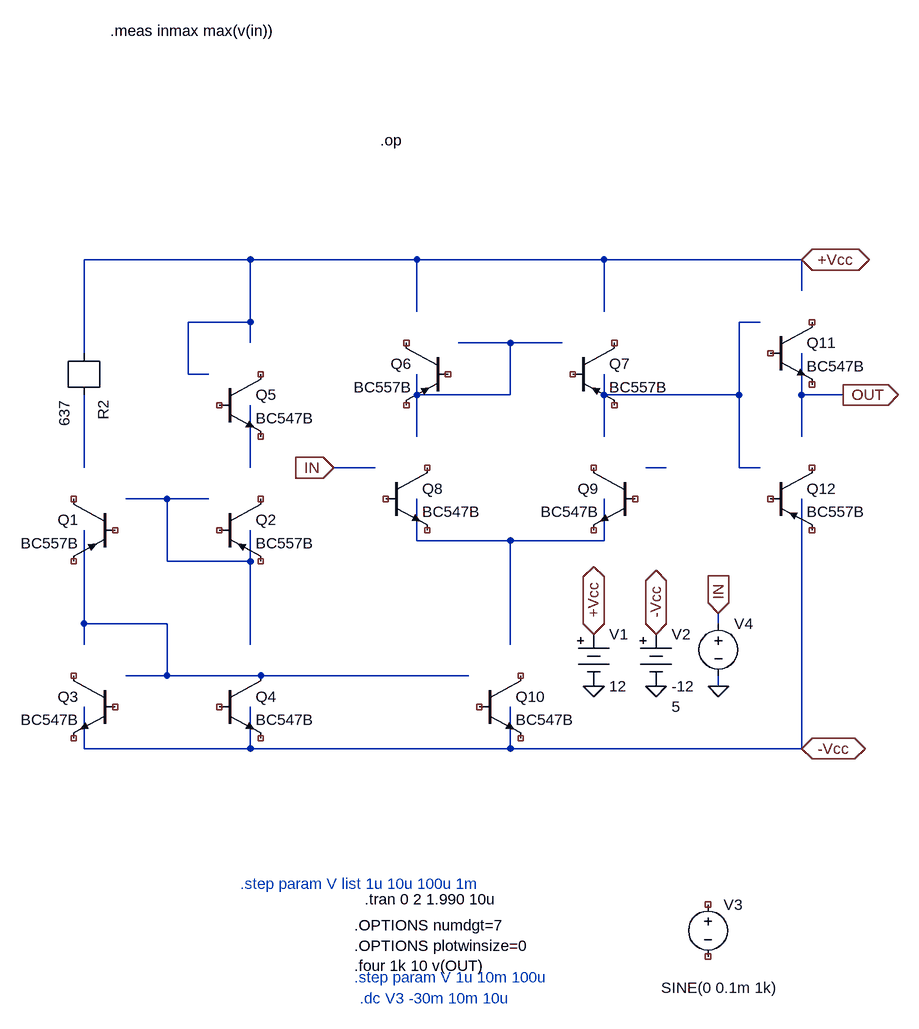
[diagram p0: schematic diff_amp_simple.asc]
diff_amp_simple.asc, the LTspice schematic file:
Version 4
SHEET 1 1452 1264
WIRE 448 112 192 112
WIRE 704 112 448 112
WIRE 992 112 704 112
WIRE 1296 112 992 112
WIRE 1296 160 1296 112
WIRE 704 192 704 112
WIRE 992 192 992 112
WIRE 448 208 448 112
WIRE 448 208 352 208
WIRE 1232 208 1200 208
WIRE 448 240 448 208
WIRE 848 240 768 240
WIRE 928 240 848 240
WIRE 192 256 192 112
WIRE 352 288 352 208
WIRE 384 288 352 288
WIRE 704 320 704 288
WIRE 848 320 848 240
WIRE 848 320 704 320
WIRE 992 320 992 288
WIRE 1200 320 1200 208
WIRE 1200 320 992 320
WIRE 1296 320 1296 256
WIRE 1360 320 1296 320
WIRE 704 384 704 320
WIRE 992 384 992 320
WIRE 1296 384 1296 320
WIRE 192 432 192 320
WIRE 448 432 448 336
WIRE 640 432 576 432
WIRE 1088 432 1056 432
WIRE 1200 432 1200 320
WIRE 1232 432 1200 432
WIRE 320 480 256 480
WIRE 384 480 320 480
WIRE 704 544 704 480
WIRE 848 544 704 544
WIRE 992 544 992 480
WIRE 992 544 848 544
WIRE 320 576 320 480
WIRE 448 576 448 528
WIRE 448 576 320 576
WIRE 192 672 192 528
WIRE 320 672 192 672
WIRE 1168 672 1168 656
WIRE 192 704 192 672
WIRE 448 704 448 576
WIRE 848 704 848 544
WIRE 320 752 320 672
WIRE 320 752 256 752
WIRE 384 752 320 752
WIRE 784 752 384 752
WIRE 1168 768 1168 752
WIRE 192 864 192 800
WIRE 448 864 448 800
WIRE 448 864 192 864
WIRE 848 864 848 800
WIRE 848 864 448 864
WIRE 1296 864 1296 480
WIRE 1296 864 848 864
FLAG 1360 320 OUT
IOPIN 1360 320 Out
FLAG 576 432 IN
IOPIN 576 432 In
FLAG 976 768 0
FLAG 1072 768 0
FLAG 976 688 +Vcc
IOPIN 976 688 BiDir
FLAG 1072 688 -Vcc
IOPIN 1072 688 BiDir
FLAG 1296 864 -Vcc
IOPIN 1296 864 BiDir
FLAG 1296 112 +Vcc
IOPIN 1296 112 BiDir
FLAG 1168 768 0
FLAG 1168 656 IN
IOPIN 1168 656 In
SYMBOL npn 240 752 M0
SYMATTR InstName Q3
SYMATTR Value BC547B
SYMBOL npn 400 752 R0
SYMATTR InstName Q4
SYMATTR Value BC547B
SYMBOL npn 400 288 R0
SYMATTR InstName Q5
SYMATTR Value BC547B
SYMBOL r 192 256 R90
SYMATTR InstName R2
SYMATTR Value 637
SYMBOL pnp 400 480 R0
SYMATTR InstName Q2
SYMATTR Value BC557B
SYMBOL pnp 240 480 M0
SYMATTR InstName Q1
SYMATTR Value BC557B
SYMBOL pnp 752 240 M0
SYMATTR InstName Q6
SYMATTR Value BC557B
SYMBOL pnp 944 240 R0
SYMATTR InstName Q7
SYMATTR Value BC557B
SYMBOL npn 656 432 R0
SYMATTR InstName Q8
SYMATTR Value BC547B
SYMBOL npn 1040 432 M0
SYMATTR InstName Q9
SYMATTR Value BC547B
SYMBOL npn 800 752 R0
SYMATTR InstName Q10
SYMATTR Value BC547B
SYMBOL npn 1248 208 R0
SYMATTR InstName Q11
SYMATTR Value BC547B
SYMBOL pnp 1248 432 R0
SYMATTR InstName Q12
SYMATTR Value BC557B
SYMBOL Misc/battery 976 672 R0
SYMATTR InstName V1
SYMATTR Value 12
SYMBOL Misc/battery 1072 672 R0
SYMATTR InstName V2
SYMATTR Value -12
SYMBOL voltage 1152 1088 R0
WINDOW 3 -72 144 Left 2
SYMATTR Value SINE(0 0.1m 1k)
SYMATTR InstName V3
SYMATTR Value2 AC 1
SYMBOL voltage 1168 656 R0
WINDOW 3 -72 144 Left 2
SYMATTR Value 5
SYMATTR InstName V4
SYMATTR Value2 AC 1
TEXT 432 1072 Left 2 ;.step param V list 1u 10u 100u 1m
TEXT 624 1096 Left 2 !.tran 0 2 1.990 10u
TEXT 648 -72 Left 2 !.op
TEXT 608 1136 Left 2 !.OPTIONS numdgt=7\n.OPTIONS plotwinsize=0\n.four 1k 10 v(OUT)
TEXT 608 1216 Left 2 ;.step param V 1u 10m 100u
TEXT 232 -240 Left 2 !.meas inmax max(v(in))
TEXT 616 1248 Left 2 ;.dc V3 -30m 10m 10u

The netlist it stands for:
* diff_amp_simple.asc
* Q3: BC547B (symbol npn not certain, pin order unknown); nets seen at it: 0
* Q4: BC547B (symbol npn not certain, pin order unknown); nets seen at it: 0, N008
* Q5: BC547B (symbol npn not certain, pin order unknown); nets seen at it: 0
R2 N003 +Vcc 637
* Q2: BC557B (symbol pnp not certain, pin order unknown); nets seen at it: 0
* Q1: BC557B (symbol pnp not certain, pin order unknown); nets seen at it: 0
* Q6: BC557B (symbol pnp not certain, pin order unknown); nets seen at it: 0
* Q7: BC557B (symbol pnp not certain, pin order unknown); nets seen at it: 0
* Q8: BC547B (symbol npn not certain, pin order unknown); nets seen at it: 0
* Q9: BC547B (symbol npn not certain, pin order unknown); nets seen at it: 0
* Q10: BC547B (symbol npn not certain, pin order unknown); nets seen at it: 0
* Q11: BC547B (symbol npn not certain, pin order unknown); nets seen at it: 0
* Q12: BC557B (symbol pnp not certain, pin order unknown); nets seen at it: 0
V1 +Vcc 0 12
V2 -Vcc 0 -12
V3 NC_36 NC_37 SINE(0 0.1m 1k) AC 1
V4 IN 0 5 AC 1
* .step param V list 1u 10u 100u 1m
.tran 0 2 1.990 10u
.op
.OPTIONS numdgt=7
.OPTIONS plotwinsize=0
.four 1k 10 v(OUT)
* .step param V 1u 10m 100u
.meas inmax max(v(in))
* .dc V3 -30m 10m 10u
.backanno
.end